# EasyEDA Pro project ProDoc_FLIP_C3_2024-10-24.epro

# Schematic flip_c3
Create Date: 2023-12-31; Page Name: P1; Project Name: FLIP_C3 Working; Schematic Name: flip_c3; Update Date: 2024-06-18; Company: Voidbox Industries; Drawed: @clomads; Page Size: A4; Part Number: JLCPCB-002; Reviewed: EasyEDA Pro; Version: 22.03
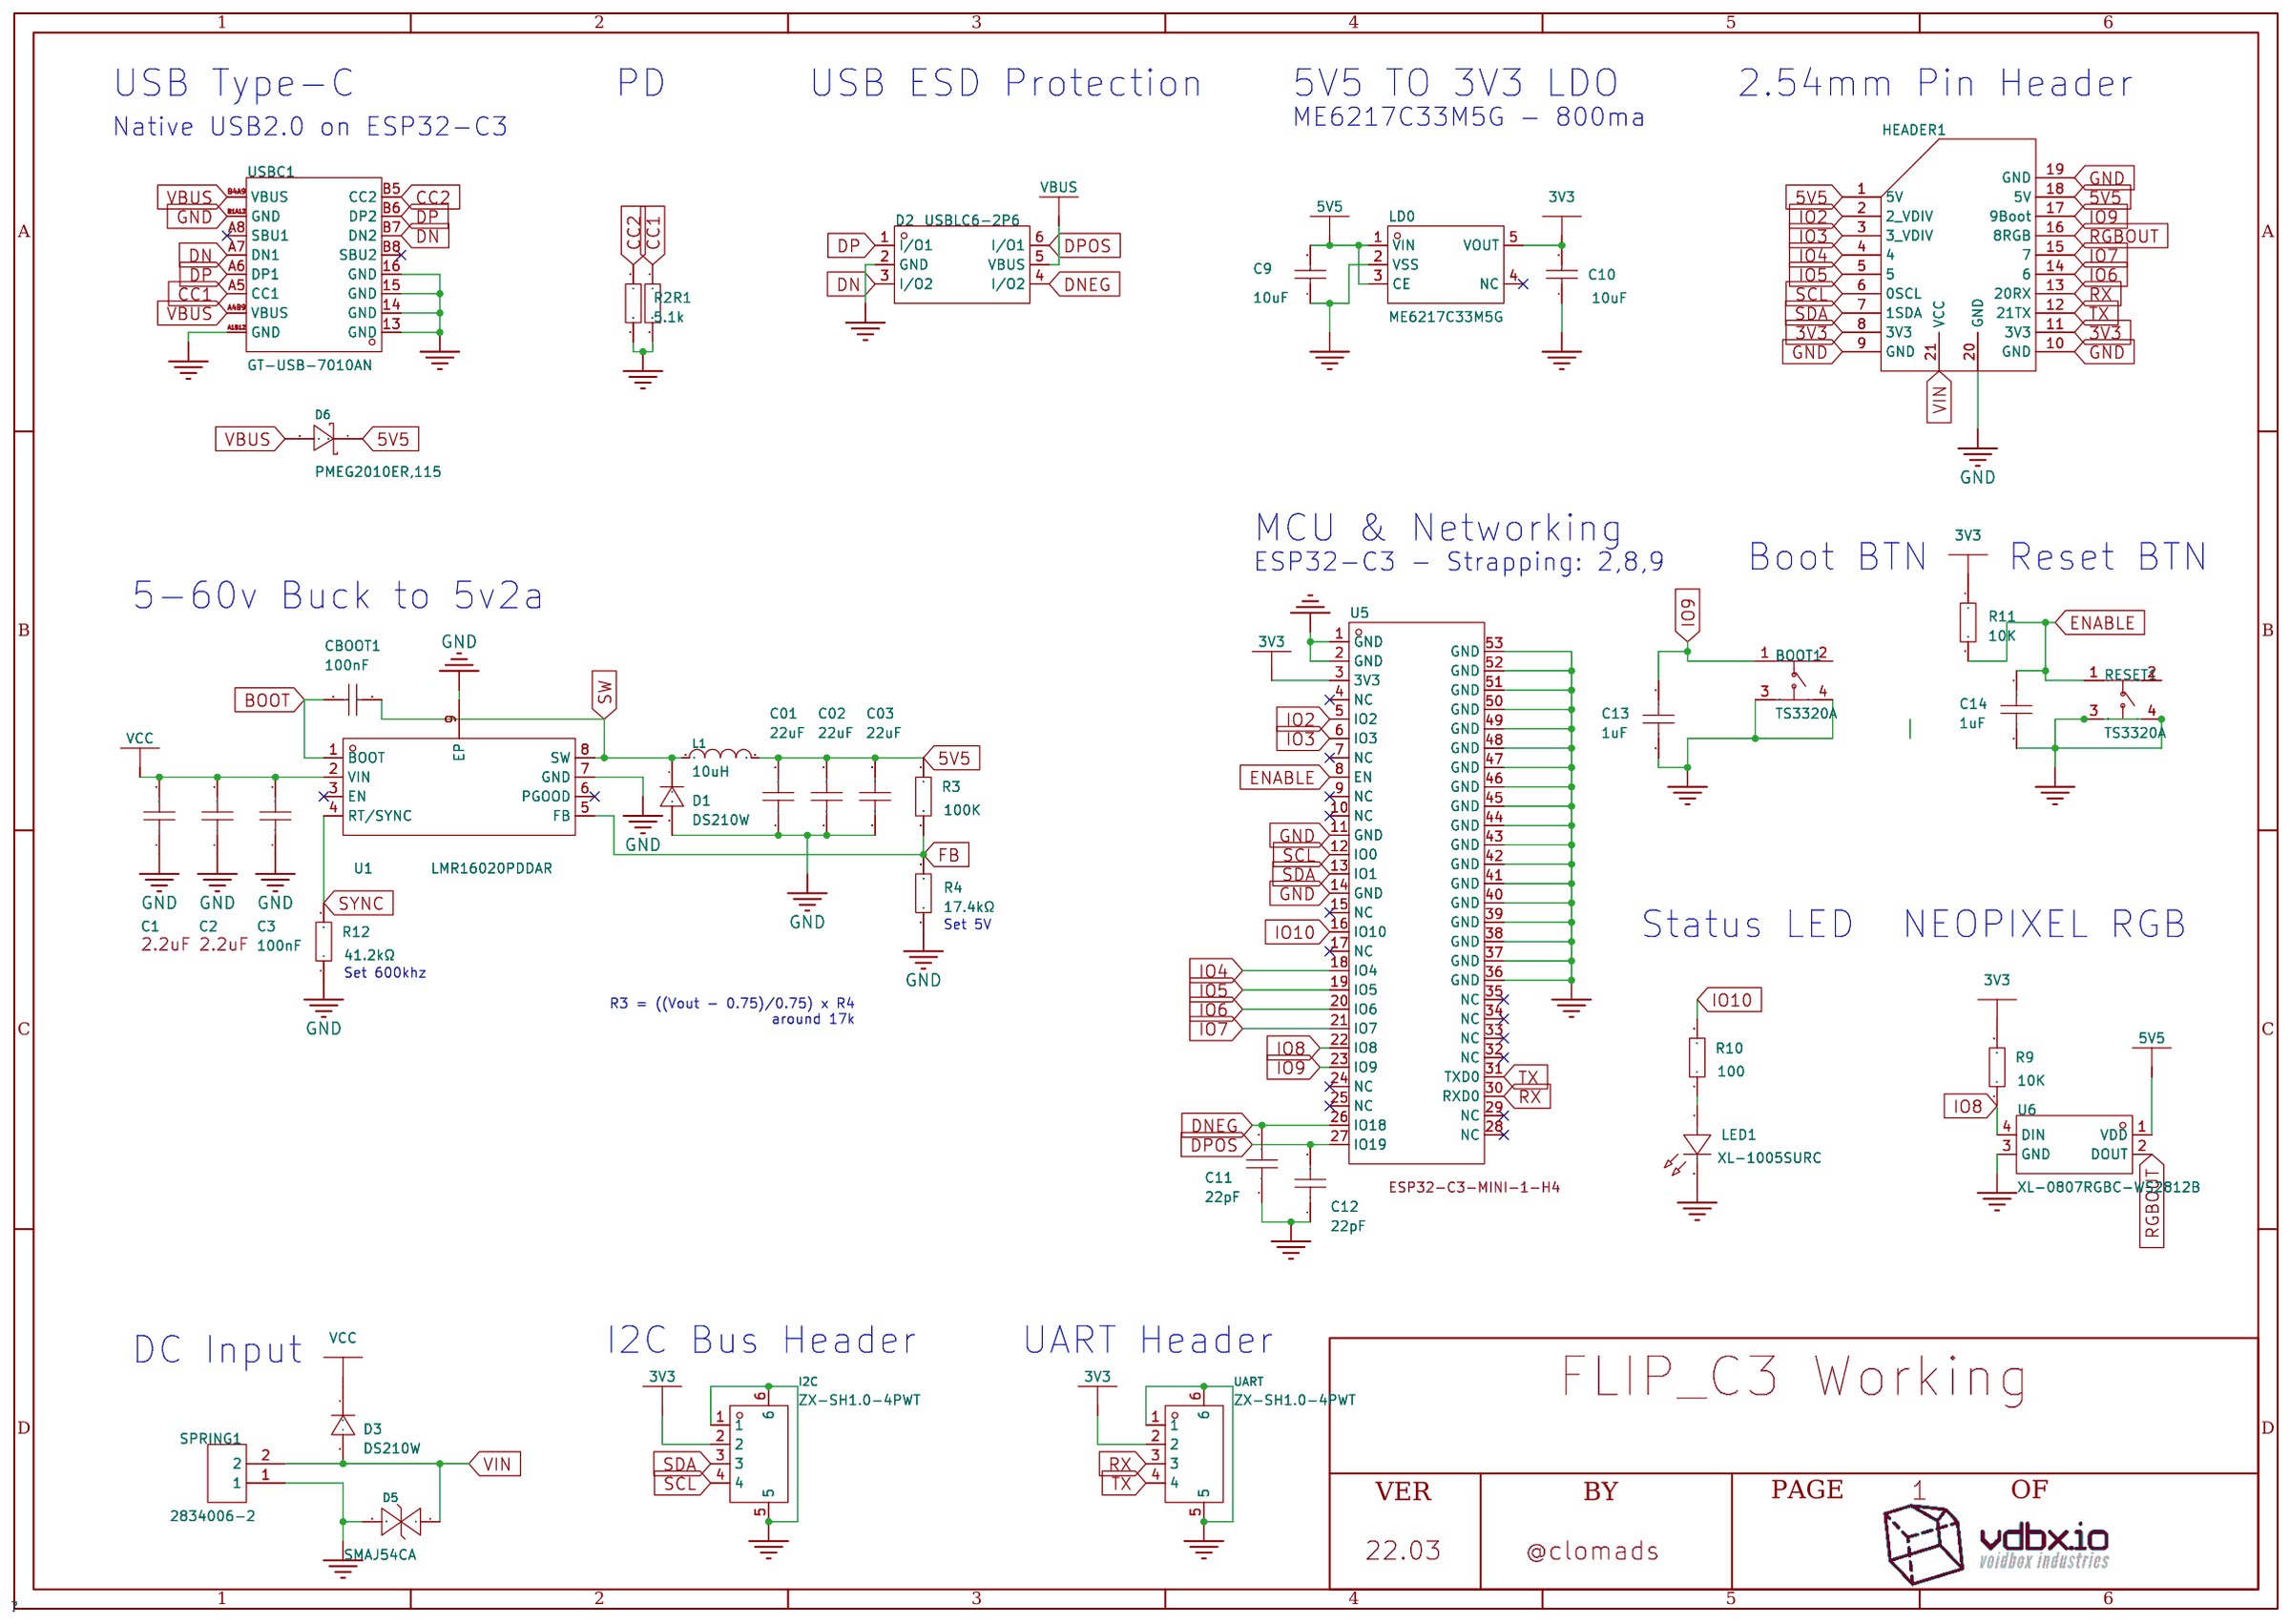
[diagram p0: schematic sheet]

## Parts
BOOT1  TS3320A  [KEY-SMD_4P-L3.3-W3.3-P2.20-LS3.9]
C1  CS3216X7R225K101NRI  [C1206]
C01  22uF  [C0805]
C2  CS3216X7R225K101NRI  [C1206]
C02  22uF  [C0805]
C3  100nF  [C0402]
C03  22uF  [C0805]
C9  10uF  [C0402]
C10  10uF  [C0402]
C11  22pF  [C0402]
C12  22pF  [C0402]
C13  1uF  [C0402]
C14  1uF  [C0402]
CBOOT1  100nF  [C0402]
D1  DS210W  [SOD-123FL_L2.7-W1.8-LS3.8-RD]
D2  USBLC6-2P6  [SOT-666-6_L1.6-W1.2-P0.50-LS1.6-BL]
D3  DS210W  [SOD-123FL_L2.7-W1.8-LS3.8-RD]
D5  SMAJ54CA  [SMA_L4.4-W2.6-LS5.0-BI]
D6  PMEG2010ER,115  [SOD-123_L2.6-W1.7-LS3.5-RD]
HEADER1  -  [VDBX//FLIP]
I2C  ZX-SH1.0-4PWT  [CONN-SMD_4P-P1.00_MEGASTAR_ZX-SH1.0-4PWT]
L1  10uH  [IND-SMD_L5.4-W5.2]
LD0  ME6217C33M5G  [SOT-23-5_L3.0-W1.7-P0.95-LS2.8-BR]
LED1  XL-1005SURC  [LED0402-R-RD_RED]
R1  5.1k  [R0402]
R2  5.1k  [R0402]
R3  100K  [R0402]
R4  17.4kΩ  [R0402]
R9  10K  [R0402]
R10  100  [R0402]
R11  10K  [R0402]
R12  41.2kΩ  [R0201]
RESET1  TS3320A  [KEY-SMD_4P-L3.3-W3.3-P2.20-LS3.9]
SPRING1  2834006-2  [CONN-SMD_2834006-2]
U1  LMR16020PDDAR  [SOIC-8_L4.9-W3.9-P1.27-LS6.0-BL-EP]
U5  2.4GHz  [WIFIM-SMD_ESP32-C3-MINI-1]
U6  XL-0807RGBC-WS2812B  [LED-SMD_4P-L2.0-W1.8_CY-0807]
UART  ZX-SH1.0-4PWT  [CONN-SMD_4P-P1.00_MEGASTAR_ZX-SH1.0-4PWT]
USBC1  GT-USB-7010AN  [USB-SMD_GT-USB-7010AN]

## Library data of the parts
BOOT1 RESET1 = TS3320A: Contact Current:50mA Voltage Rating (DC):12V Insulation Resistance:100MΩ Circuit:SPST Mounting Style:Brick nogging Actuator Style:Round Button Actuator/Cap Color:Black Mechanical Life:50000次 Operating Temperature:-25℃~+70℃ Operating Temperature:-25℃~+70℃; LCSC Part Name: 3.3*3.3*2mm立贴轻触开关-; Supplier Part: C2681475; Manufacturer: SHOUHAN(首韩); Supplier Footprint: SMD; JLCPCB Part Class: ExtendedPart; Datasheet: https://atta.szlcsc.com/upload/public/pdf/source/20210224/C2681475_49BAFF82C70BBEACA3FDEB8209DED2EE.pdf; Supplier: LCSC; Contact Current: 50mA; Voltage Rating (DC): 12V; Insulation Resistance: 100MΩ; Circuit: SPST; Mounting Style: Bricknogging; Actuator Style: RoundButton; Actuator/Cap Color: Black; Mechanical Life: 50000次; Operating Temperature: -25℃~+70℃; Pin Style: SMDSplicing; Switch Length: 3.3mm; Switch Width: 3.3mm; Switch Height: 2mm; Strike Gundam: NO
C1 = CS3216X7R225K101NRI: 2.2uF; LCSC Part Name: 2.2uF±10%100V; Supplier Part: C920964; Manufacturer: SAMWHA(三和); Supplier Footprint: 1206; Supplier: LCSC
C01 C02 C03 = CL21A226MAQNNNE_C45783: Capacitance: Tolerance:±20% Tolerance:±20% Voltage Rated: Temperature Coefficient:; LCSC Part Name: 22uF±20%25V; Supplier Part: C45783; Manufacturer: SAMSUNG(三星); Manufacturer Part: CL21A226MAQNNNE; Supplier Footprint: 0805; JLCPCB Part Class: BasicPart; Datasheet: https://atta.szlcsc.com/upload/public/pdf/source/20160103/1457707727161.pdf; Supplier: LCSC; Tolerance: ±20%
C2 = CS3216X7R225K101NRI: 2.2uF; LCSC Part Name: 2.2uF ±10% 100V; Supplier Part: C920964; Manufacturer: SAMWHA(三和); Supplier Footprint: 1206; Supplier: LCSC
C3 = GRM155R62A104KE14D: Capacitance: Tolerance:±10% Tolerance:±10% Voltage Rated: Temperature Coefficient:; LCSC Part Name: 100nF±10%100V; Supplier Part: C162178; Manufacturer: muRata(村田); Supplier Footprint: 0402; JLCPCB Part Class: ExtendedPart; Datasheet: https://atta.szlcsc.com/upload/public/pdf/source/20200921/C162178_EF61A2DC43497DE67E2F462D3389BE9B.pdf; Supplier: LCSC; Tolerance: ±10%
C9 C10 = CL05A106MQ5NUNC: Capacitance: Tolerance:±20% Tolerance:±20% Voltage Rated: Temperature Coefficient:; LCSC Part Name: 10uF±20%6.3V; Supplier Part: C15525; Manufacturer: SAMSUNG(三星); Supplier Footprint: 0402; JLCPCB Part Class: BasicPart; Datasheet: https://atta.szlcsc.com/upload/public/pdf/source/20220823/2B02EE04F8F211D38A52DCB16EB6BEBA.pdf; Supplier: LCSC; Tolerance: ±20%
C11 C12 = AC0402JRNPO9BN220: Capacitance: Tolerance:±5% Tolerance:±5% Voltage Rated: Temperature Coefficient:; LCSC Part Name: 22pF±5%50V; Supplier Part: C726125; Manufacturer: YAGEO(国巨); Supplier Footprint: 0402; JLCPCB Part Class: ExtendedPart; Datasheet: https://atta.szlcsc.com/upload/public/pdf/source/20200820/C726125_11F3A014E965DE2ED5817C34A65FFB04.pdf; Supplier: LCSC; Tolerance: ±5%
C13 C14 = TCC0402X5R105K6R3AT: Capacitance: Tolerance:±10% Tolerance:±10% Voltage Rated: Temperature Coefficient:; LCSC Part Name: 1uF±10%6.3V; Supplier Part: C380294; Manufacturer: CCTC(三环); Supplier Footprint: 0402; JLCPCB Part Class: ExtendedPart; Datasheet: https://atta.szlcsc.com/upload/public/pdf/source/20190416/C380294_EE4A8BABBF3DD61F3AECEC3178C6A1B3.pdf; Supplier: LCSC; Tolerance: ±10%
CBOOT1 = 0402B104K160NT: Capacitance: Tolerance:±10% Tolerance:±10% Voltage Rated: Temperature Coefficient:; LCSC Part Name: 100nF±10%16V; Supplier Part: C41851; Manufacturer: FH(风华); Supplier Footprint: 0402; JLCPCB Part Class: ExtendedPart; Datasheet: https://atta.szlcsc.com/upload/public/pdf/source/20170923/C41851_1506149456453988767.pdf; Supplier: LCSC; Tolerance: ±10%
D1 D3 = DS210W: Reverse Voltage (Vr):100V Average Rectified Current (Io):2A Forward Voltage (Vf@If):850mV@2A; LCSC Part Name: 100V2A850mV@2A; Supplier Part: C116100; Manufacturer: 晶导微电子; Supplier Footprint: SOD-123F; JLCPCB Part Class: ExtendedPart; Datasheet: https://atta.szlcsc.com/upload/public/pdf/source/20170630/1498816633495.pdf; Supplier: LCSC; Reverse Voltage (Vr): 100V; Average Rectified Current (Io): 2A; Forward Voltage (Vf@If): 850mV@2A
D2 = USBLC6-2P6: LCSC Part Name: MSL=3; Supplier Part: C2827693; Manufacturer: TECHPUBLIC(台舟); Supplier Footprint: SOT-666-6; JLCPCB Part Class: ExtendedPart; Datasheet: https://atta.szlcsc.com/upload/public/pdf/source/20210810/36353A9194EA9F4E33F8AE18BE051AEA.pdf; Supplier: LCSC
D5 = SMAJ54CA_C726801: LCSC Part Name: 双向TVS 54V截止 4.6A峰值脉冲; Supplier Part: C726801; Manufacturer: TWGMC(台湾迪嘉); Supplier Footprint: SMA(DO-214AC); JLCPCB Part Class: Extended Part; Datasheet: https://atta.szlcsc.com/upload/public/pdf/source/20200827/C726731_3930C18E0BE7F90724BF034A8102E5CA.pdf; Supplier: LCSC
D6 = PMEG2010ER,115: Forward Voltage (Vf@If):340mV@1A Reverse Voltage (Vr):20V Average Rectified Current (Io):1A Reverse Leakage Current (Ir):1mA@20V; LCSC Part Name: 电压:20V 电流:1A; Supplier Part: C82288; Manufacturer: Nexperia(安世); Supplier Footprint: SOD-123W; JLCPCB Part Class: Extended Part; Datasheet: https://atta.szlcsc.com/upload/public/pdf/source/20190724/C82288_10225E21959A121382FBC249BE727A6A.pdf; Supplier: LCSC; Forward Voltage (Vf@If): 340mV@1A; Reverse Voltage (Vr): 20V; Average Rectified Current (Io): 1A; Reverse Leakage Current (Ir): 1mA@20V
HEADER1 = VDBX//FLIP: 2.54mm DIP header for VDBX//FLIP
I2C UART = ZX-SH1.0-4PWT: Pins Structure:1x4P Pitch:1mm Mounting Style:Surface Mount Row Spacing:- Number of Pins:4P Number of Rows:1 Number of PINs Per Row:4 Reference Series:SH Current Rating (Max):1A Contact Material:Brass Contact Plating:Tin Operating Temperature Range:-25℃~+8; LCSC Part Name: 1x4P 间距:1mm 卧贴 系列:SH; Supplier Part: C7430446; Manufacturer: Megastar(兆星); Supplier Footprint: SMD,P=1mm; JLCPCB Part Class: Extended Part; Datasheet: https://atta.szlcsc.com/upload/public/pdf/source/20230619/390816C24B7A0EB1D042395C380CEA99.pdf; Supplier: LCSC; Pins Structure: 1x4P; Pitch: 1mm; Mounting Style: Surface Mount; Number of Pins: 4P; Number of Rows: 1; Number of PINs Per Row: 4; Reference Series: SH; Current Rating (Max): 1A; Contact Material: Brass; Contact Plating: Tin; Operating Temperature Range: -25℃~+85℃
L1 = YSPI0530-100M: Inductance: Tolerance:±20% Tolerance:±20% Rated Current: DC Resistance (DCR):; LCSC Part Name: 10uH ±20%; Supplier Part: C351099; Manufacturer: YJYCOIN(益嘉源); Supplier Footprint: SMD,5.4x5.2x3mm; JLCPCB Part Class: Extended Part; Datasheet: https://atta.szlcsc.com/upload/public/pdf/source/20200623/C351094_17389D97D1B03B4819FE4163F927344F.pdf; Supplier: LCSC; Tolerance: ±20%
LD0 = ME6217C33M5G: Supplier Part: C427602; Manufacturer: MICRONE(南京微盟); Supplier Footprint: SOT-23-5; Datasheet: https://atta.szlcsc.com/upload/public/pdf/source/20190910/C427602_D4B9162A2E9D9EF57C60010DFDECEF37.pdf; Supplier: LCSC
LED1 = XL-1005SURC: LCSC Part Name: 0402红色(Iv=100-110mcd(Typ)@IF=5mA); Supplier Part: C965790; Manufacturer: XINGLIGHT(成兴光); Supplier Footprint: 0402; JLCPCB Part Class: ExtendedPart; Datasheet: https://atta.szlcsc.com/upload/public/pdf/source/20201230/C965790_D08D7AE59F006B2C4755D0738B261672.pdf; Supplier: LCSC
R1-R3 R9-R11 = Res_0402: Supplier Footprint: 0402
R4 = AC0402FR-0717K4L: Type:Thick Film Resistors Resistance: Tolerance:±1% Tolerance:±1% Power(Watts): Temperature Coefficient:±100ppm/℃ Temperature Coefficient:±100ppm/℃ Overload Voltage (Max): Operating Temperature Range:-55℃~+155℃ Operating Temperature Range:-55℃~+155℃; LCSC Part Name: 17.4kΩ±1%62.5mW; Supplier Part: C226818; Manufacturer: YAGEO(国巨); Supplier Footprint: 0402; JLCPCB Part Class: ExtendedPart; Datasheet: https://atta.szlcsc.com/upload/public/pdf/source/20190123/C226818_28D8B305D22560CEE1489EF0EB7B82C0.pdf; Supplier: LCSC; Type: ThickFilmResistors; Tolerance: ±1%; Temperature Coefficient: ±100ppm/℃; Operating Temperature Range: -55℃~+155℃
R12 = RC0201FR-0741K2L: Type:Thick Film Resistors Resistance: Tolerance:±1% Tolerance:±1% Power(Watts): Temperature Coefficient:±200ppm/℃ Temperature Coefficient:±200ppm/℃ Overload Voltage (Max): Operating Temperature Range:-55℃~+125℃ Operating Temperature Range:-55℃~+125℃; LCSC Part Name: 41.2kΩ±1%50mW; Supplier Part: C327387; Manufacturer: YAGEO(国巨); Supplier Footprint: 0201; JLCPCB Part Class: ExtendedPart; Datasheet: https://atta.szlcsc.com/upload/public/pdf/source/20181031/C327387_F1DBB3BE8B4A4576AB16EF1D0BA24538.pdf; Supplier: LCSC; Type: ThickFilmResistors; Tolerance: ±1%; Temperature Coefficient: ±200ppm/℃; Operating Temperature Range: -55℃~+125℃
SPRING1 = 2834006-2: Pitch:4mm Number of PINs Per Row:2 Number of Rows:1 Mounting Style:Surface Mount Current Rating (Max):- Voltage Rating (Max):- Wire Gauge - AWG:- Wire Gauge - mm?:- Operating Temperature Range:- Operating Temperature Range:- Color:Creamy-White; LCSC Part Name: 4mm每排P数:2排数:1; Supplier Part: C86483; Manufacturer: TEConnectivity(美国泰科); Supplier Footprint: P=4mm; JLCPCB Part Class: ExtendedPart; Datasheet: https://atta.szlcsc.com/upload/public/pdf/source/20161105/1478330329472.pdf; Supplier: LCSC; Pitch: 4mm; Number of PINs Per Row: 2; Number of Rows: 1; Mounting Style: SurfaceMount; Color: Creamy-White
U1 = LMR16020PDDAR: Function:Step-down type Synchronous Rectification:NO Output Type:Adjustable Number of Outputs:1 Topology:Step-down Input Voltage:4.3V~60V Input Voltage:4.3V~60V Output Voltage:0.8V~50V Output Voltage:0.8V~50V Output Current (Max):2A Switching Frequency:2.; LCSC Part Name: 降压型Vin=4.3V~60VVout=800mV~50V2A; Supplier Part: C190006; Manufacturer: TI(德州仪器); Supplier Footprint: SOIC-8-EP; JLCPCB Part Class: ExtendedPart; Datasheet: https://atta.szlcsc.com/upload/public/pdf/source/20180404/C190006_9C8896A9199409761EDE7FC724CBBE1D.pdf; Supplier: LCSC; Function: Step-downtype; Synchronous Rectification: NO; Output Type: Adjustable; Number of Outputs: 1; Topology: Step-down; Input Voltage: 4.3V~60V; Output Voltage: 0.8V~50V; Output Current (Max): 2A; Switching Frequency: 2.5MHz; Operating Temperature: -40℃~+125℃@(TJ)
U5 = ESP32-C3-MINI-1-H4_C2934569: Frequency:2.4GHz Output Power:20.5dBm Output Power:20.5dBm Core Processor:RISC-V Support Interface:SPI Antenna Type:板载 PCB Antenna/外部Antenna连接器 Wireless Standard:802.11b/g/n Operating Voltage:3.3V Operating Voltage:3.3V Receive  Current:- Send  Current:-; LCSC Part Name: ESP32-C3-MINI-1-H4; Supplier Part: C2934569; Manufacturer: ESPRESSIF(乐鑫); Manufacturer Part: ESP32-C3-MINI-1-H4; Supplier Footprint: SMD,13.2x16.6mm; Datasheet: https://atta.szlcsc.com/upload/public/pdf/source/20211222/4A6E563D9536B67D492463D36DD57C1D.pdf; Supplier: LCSC; Output Power: 20.5dBm; Core Processor: RISC-V; Support Interface: SPI; Antenna Type: 板载PCBAntenna/外部Antenna连接器; Wireless Standard: 802.11b/g/n; Operating Voltage: 3.3V; Sensitivity: -96dBm; Operating Temperature: -40℃~+85℃
U6 = XL-0807RGBC-WS2812B: Emitted Color:RGB Diode Configuration:- Lens Color:Colorless Dominant Wavelength:- Dominant Wavelength:- Peak Wavelength:- Color Temperature:- Color Temperature:- Luminous Flux (@25℃):- Luminous Flux (@25℃):- Forward Current:20mA Forward Voltage (VF):3.5V; LCSC Part Name: RGB三色正贴; Supplier Part: C3646929; Manufacturer: XINGLIGHT(成兴光); Supplier Footprint: SMD,1.8x2mm; JLCPCB Part Class: ExtendedPart; Datasheet: https://atta.szlcsc.com/upload/public/pdf/source/20220704/8AC05C59AC3A71CCA97D1D2180172B1A.pdf; Supplier: LCSC; Emitted Color: RGB; Lens Color: Colorless; Forward Current: 20mA; Forward Voltage (VF): 3.5V~5.5V; Viewing Angle: 120°; Mounting Sytle: Positivepost; Operating Temperature: -40℃~+150℃
USBC1 = GT-USB-7010AN: LCSC Part Name: 16PINTYPE-C母座; Supplier Part: C963370; Manufacturer: G-Switch(品赞); Supplier Footprint: 8.94x3.16x7.35mm; JLCPCB Part Class: ExtendedPart; Supplier: LCSC

## Nets
3V3: C10.2 HEADER1.8(3V3) HEADER1.11(3V3) I2C.2 LD0.5(VOUT) R9.2 R11.1 U5.3(3V3) UART.2
5V5: C01.2 C02.2 C03.2 C9.2 D6.1(C) HEADER1.1(5V) HEADER1.18(5V) L1.2 LD0.1(VIN) LD0.3(CE) R3.2 U6.1(VDD)
GND: BOOT1.3 BOOT1.4 C1.1 C01.1 C2.1 C02.1 C3.1 C03.1 C9.1 C10.1 C11.1 C12.1 C13.2 C14.2 D1.2(A) D2.2(GND) D5.2 HEADER1.9(GND) HEADER1.10(GND) HEADER1.19(GND) HEADER1.20(GND) I2C.1 I2C.5 I2C.6 LD0.2(VSS) LED1.2(A) R1.2 R2.2 R4.1 R12.1 RESET1.3 RESET1.4 SPRING1.1 U1.7(GND) U1.9(EP) U5.1(GND) U5.2(GND) U5.11(GND) U5.14(GND) U5.36(GND) U5.37(GND) U5.38(GND) U5.39(GND) U5.40(GND) U5.41(GND) U5.42(GND) U5.43(GND) U5.44(GND) U5.45(GND) U5.46(GND) U5.47(GND) U5.48(GND) U5.49(GND) U5.50(GND) U5.51(GND) U5.52(GND) U5.53(GND) U6.3(GND) UART.1 UART.5 UART.6 USBC1.13(GND) USBC1.14(GND) USBC1.15(GND) USBC1.16(GND) USBC1.A1B12(GND) USBC1.B1A12(GND)
VBUS: D2.5(VBUS) D6.2(A) USBC1.A4B9(VBUS) USBC1.B4A9(VBUS)
VCC: C1.2 C2.2 C3.2 D3.1(C) U1.2(VIN)
VIN: D3.2(A) D5.1 HEADER1.21(VCC) SPRING1.2
BOOT: CBOOT1.2 U1.1(BOOT)
CC1: R1.1 USBC1.A5(CC1)
CC2: R2.1 USBC1.B5(CC2)
DN: D2.3(I/O2) USBC1.A7(DN1) USBC1.B7(DN2)
DNEG: C11.2 D2.4(I/O2) U5.26(IO18)
DP: D2.1(I/O1) USBC1.A6(DP1) USBC1.B6(DP2)
DPOS: C12.2 D2.6(I/O1) U5.27(IO19)
ENABLE: C14.1 R11.2 RESET1.1 U5.8(EN)
FB: R3.1 R4.2 U1.5(FB)
IO2: HEADER1.2(2 VDIV) U5.5(IO2)
IO3: HEADER1.3(3 VDIV) U5.6(IO3)
IO4: HEADER1.4 U5.18(IO4)
IO5: HEADER1.5 U5.19(IO5)
IO6: HEADER1.14(6) U5.20(IO6)
IO7: HEADER1.15(7) U5.21(IO7)
IO8: R9.1 U5.22(IO8) U6.4(DIN)
IO9: BOOT1.1 C13.1 HEADER1.17(9Boot) U5.23(IO9)
IO10: R10.2 U5.16(IO10)
RGBOUT: HEADER1.16(8RGB) U6.2(DOUT)
RX: HEADER1.13(20RX) U5.30(RXD0) UART.3
SCL: HEADER1.6(0SCL) I2C.4 U5.12(IO0)
SDA: HEADER1.7(1SDA) I2C.3 U5.13(IO1)
SW: CBOOT1.1 D1.1(C) L1.1 U1.8(SW)
SYNC: R12.2 U1.4(RT/SYNC)
TX: HEADER1.12(21TX) U5.31(TXD0) UART.4
$1N39228: LED1.1(K) R10.1

Not connected (* = marked no-connect by the designer): BOOT1 2; LD0 4(NC)*; RESET1 2; U1 3(EN)* 6(PGOOD)*; U5 4(NC)* 7(NC)* 9(NC)* 10(NC)* 15(NC)* 17(NC)* 24(NC)* 25(NC)* 28(NC)* 29(NC)* 32(NC)* 33(NC)* 34(NC)* 35(NC)*; USBC1 A8(SBU1)* B8(SBU2)*

## Notes on the sheet
- USB Type-C
- PD
- USB ESD Protection
- 5V5 TO 3V3 LDO
- 2.54mm Pin Header
- ME6217C33M5G - 800ma
- Native USB2.0 on ESP32-C3
- MCU & Networking
- ESP32-C3 - Strapping: 2,8,9
- Boot BTN
- Reset BTN
- 5-60v Buck to 5v2a
- Set 5V
- Status LED
- NEOPIXEL RGB
- Set 600khz
- R3 = ((Vout - 0.75)/0.75) x R4
  around 17k
- DC Input
- I2C Bus Header
- UART Header

# Board FLIP_C3
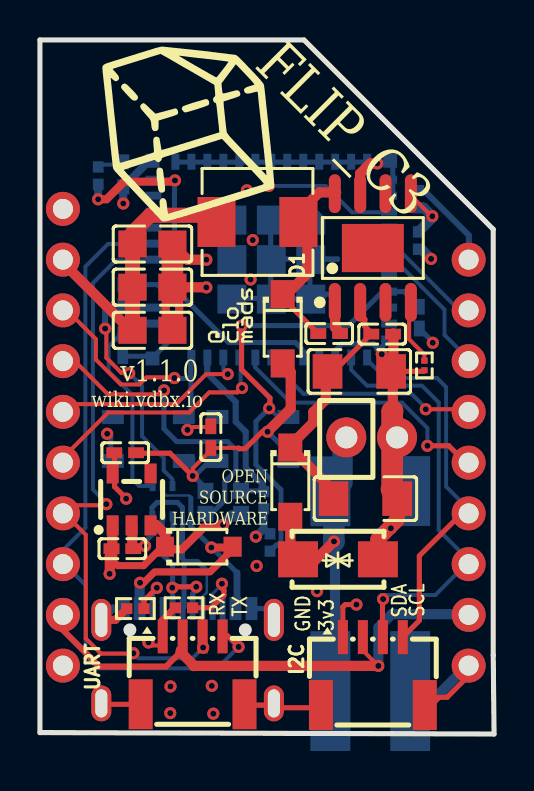
[diagram p1: board, top side]
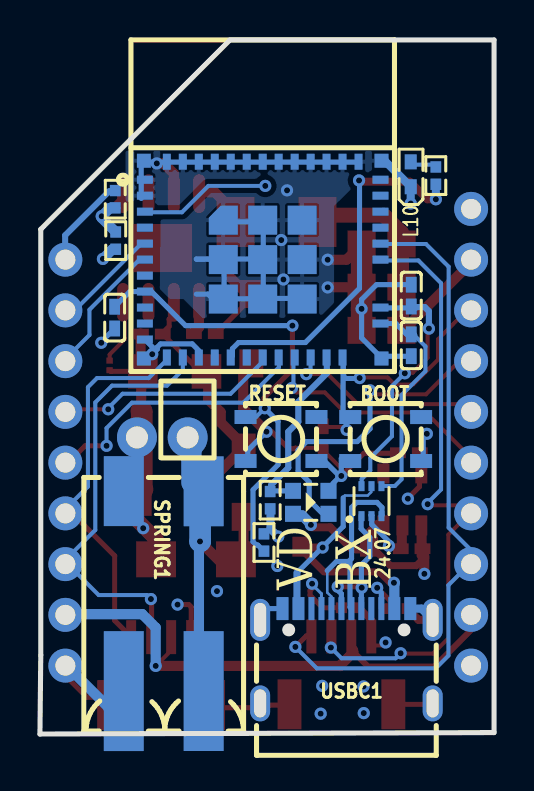
[diagram p2: board, bottom side, seen from below]

Outline 22.74 x 34.74 mm; copper layers: Top Layer, Inner1, Inner2, Bottom Layer. Coordinates in mm from the lower left corner of the outline.
Outline path: 0,34.74 13.22,34.74 22.7,25.26 22.7,3.95 22.74,0 0,0.07 0,34.74
Stack: Top Layer 0.035mm / Dielectric1 0.48mm PP er 4.5 / Inner1 0.035mm / Dielectric2 0.48mm FR4 er 4.5 / Inner2 0.035mm / Dielectric3 0.48mm PP er 4.5 / Bottom Layer 0.035mm

## Design rules (mm)
template: User Custom Config
spacing safeClearance (default): track to track 0.152, other pairs 0.152 to 0.3
track width trackWidth (default): min 0.102, default 0.254, max 2.54
differential pair differentialPair (default): width min 0.127, default 0.254, max 2.54; gap min 0.152, default 0.152
via viaSize (default): diameter min 0.5, default 0.61, max 10; hole min 0.3, default 0.305, max 6
net GND uses copperRegion6
pour e909 uses copperRegion6

## Placement (name value [footprint] x y rotation side)
BOOT  -  [KEY-SMD_4P-L3.3-W3.3-P2.20-LS3.9]  5.43 14.76 180 bottom
C01  22uF  [C0805]  5.63 24.52 180 top
C1  CS3216X7R225K101NRI  [C1206]  16 18.15 180 top
C02  22uF  [C0805]  5.63 22.37 180 top
C2  CS3216X7R225K101NRI  [C1206]  16.3 11.78 180 top
C3  100nF  [C0402]  17.14 20.02 180 top
C03  22uF  [C0805]  5.63 20.21 180 top
C9  10uF  [C0402]  4.13 9.28 180 top
C10  10uF  [C0402]  4.27 14.08 180 top
C11  22pF  [C0402]  4.15 19.46 90 bottom
C12  22pF  [C0402]  4.15 21.95 270 bottom
C13  1uF  [C0402]  8.56 14.86 270 top
C14  1uF  [C0402]  19 20.84 270 bottom
CBOOT1  100nF  [C0402]  14.48 20.05 0 top
D1  DS210W  [SOD-123FL_L2.7-W1.8-LS3.8-RD]  12.16 20.29 270 top
D2  USBLC6-2P6  [SOT-666-6_L1.6-W1.2-P0.50-LS1.6-BL]  6.14 11.66 180 bottom
D3  DS210W  [SOD-123FL_L2.7-W1.8-LS3.8-RD]  12.54 12.61 270 top
D5  SMAJ54CA  [SMA_L4.4-W2.6-LS5.0-BI]  14.93 8.75 0 top
D6  PMEG2010ER,115  [SOD-123_L2.6-W1.7-LS3.5-RD]  7.95 9.38 0 top
HEADER1  -  [VDBX//FLIP]  7.5 22.47 0 top
I2C  ZX-SH1.0-4PWT  [CONN-SMD_4P-P1.00_MEGASTAR_ZX-SH1.0-4PWT]  16.67 3.15 0 top
L1  10uH  [IND-SMD_L5.4-W5.2]  10.89 25.63 0 top
LD0  ME6217C33M5G  [SOT-23-5_L3.0-W1.7-P0.95-LS2.8-BR]  4.59 11.74 270 top
LED1  XL-1005SURC  [LED0402-R-RD_RED]  4.17 28.02 90 bottom
R1  5.1k  [R0402]  7.22 6.32 180 top
R2  5.1k  [R0402]  4.78 6.28 180 top
R3  100K  [R0402]  18.97 26.77 90 bottom
R4  17.4kΩ  [R0402]  18.95 24.7 90 bottom
R9  10K  [R0402]  11.21 11.7 270 bottom
R10  100  [R0402]  2.92 27.95 270 bottom
R11  10K  [R0402]  11.53 9.59 270 bottom
R12  41.2kΩ  [R0201]  19.25 18.45 90 top
RESET  -  [KEY-SMD_4P-L3.3-W3.3-P2.20-LS3.9]  10.67 14.77 180 bottom
SPRING1  2834006-2  [CONN-SMD_2834006-2]  16.54 7.15 270 bottom
U1  LMR16020PDDAR  [SOIC-8_L4.9-W3.9-P1.27-LS6.0-BL-EP]  16.67 24.33 0 top
U5  2.4GHz  [wifim-smd_esp32-c3-mini-1]  11.59 23.75 180 bottom
U6  XL-0807RGBC-WS2812B  [LED-SMD_4P-L2.0-W1.8_CY-0807]  9.18 11.6 0 bottom
UART  ZX-SH1.0-4PWT  [CONN-SMD_4P-P1.00_MEGASTAR_ZX-SH1.0-4PWT]  7.65 3.19 0 top
USBC1  GT-USB-7010AN  [USB-SMD_GT-USB-7010AN]  7.39 3.91 180 bottom

## Footprints (pads in the part's own frame, mm; a bottom-side part is the same pattern mirrored in y, then rotated)
C0402
  rect 0.79x0.54 smd: 1(-0.545,0) 2(0.545,0)
C0805
  rect 1.41x1.35 smd: 1(-1,0) 2(1,0)
C1206
  rect 1.485x1.728 smd: 1(-1.593,0) 2(1.593,0)
CONN-SMD_4P-P1.00_MEGASTAR_ZX-SH1.0-4PWT
  rect 0.5x1.7 smd: 1(-1.5,1.7) 2(-0.5,1.7) 3(0.5,1.7) 4(1.5,1.7)
  rect 1.2x2.5 smd: 5(2.6,-1.7) 6(-2.6,-1.7)
CONN-SMD_2834006-2
  rect 3.5x2 smd: 1(-5.005,-2) 2(-4.997,2)
  rect 6x2 smd: 1(5.005,-2) 2(5.002,2)
IND-SMD_L5.4-W5.2
  rect 1.9x2.5 smd: 1(2.05,0) 2(-2.05,0)
KEY-SMD_4P-L3.3-W3.3-P2.20-LS3.9
  rect 1.1x0.7 smd: 1(-1.775,1.1) 2(1.775,1.1) 3(-1.775,-1.1) 4(1.775,-1.1)
LED0402-R-RD_RED
  rect 0.75x0.6 smd: 1(0.623,0) 2(-0.623,0)
LED-SMD_4P-L2.0-W1.8_CY-0807
  rect 0.8x0.8 smd: 1(0.889,0.575) 2(-0.889,0.575) 3(-0.889,-0.575) 4(0.889,-0.575)
R0201
  rect 0.303x0.324 smd: 1(-0.241,0) 2(0.241,0)
R0402
  rect 0.566x0.54 smd: 1(-0.433,0) 2(0.433,0)
SMA_L4.4-W2.6-LS5.0-BI
  rect 2x1.8 smd: 1(-2,0) 2(2,0)
SOD-123_L2.6-W1.7-LS3.5-RD
  rect 0.9x1 smd: 1(-1.692,0) 2(1.692,0)
SOD-123FL_L2.7-W1.8-LS3.8-RD
  rect 1.4x1.2 smd: 1(-1.735,0) 2(1.735,0)
SOIC-8_L4.9-W3.9-P1.27-LS6.0-BL-EP
  oval 0.602x1.941 smd: 1(-1.905,-2.72) 2(-0.635,-2.72) 3(0.635,-2.72) 4(1.905,-2.72) 5(1.905,2.72) 6(0.635,2.72) 7(-0.635,2.72) 8(-1.905,2.72)
  rect 3.098x2.41 smd: 9(0,0)
SOT-23-5_L3.0-W1.7-P0.95-LS2.8-BR
  rect 1x0.6 smd: 1(1.3,-0.95) 2(1.3,0) 3(1.3,0.95) 4(-1.3,0.95) 5(-1.3,-0.95)
SOT-666-6_L1.6-W1.2-P0.50-LS1.6-BL
  rect 0.3x0.5 smd: 1(-0.5,-0.75) 2(0,-0.75) 3(0.5,-0.75) 4(0.5,0.75) 5(0,0.75) 6(-0.5,0.75)
USB-SMD_GT-USB-7010AN
  oval 1x2.1 hole 0.6x1.7: 13(-4.32,1.808) 14(4.32,1.808)
  oval 1x1.8 hole 0.6x1.4: 15(-4.32,-2.373) 16(4.32,-2.373)
  rect 0.6x1.15 smd: A1B12(-3.2,2.373) A4B9(-2.4,2.373) B1A12(3.2,2.373) B4A9(2.4,2.373)
  rect 0.3x1.15 smd: A5(-1.25,2.373) A6(-0.25,2.373) A7(0.25,2.373) A8(1.25,2.373) B5(1.75,2.373) B6(0.75,2.373) B7(-0.75,2.373) B8(-1.75,2.373)
VDBX//FLIP
  round 1.7 hole 1: 1(13.97,1.27) 2(13.97,-1.27) 3(13.97,-3.81) 4(13.97,-6.35) 5(13.97,-8.89) 6(13.97,-11.43) 7(13.97,-13.97) 8(13.97,-16.51) 9(13.97,-19.05) 10(-6.35,-19.05) 11(-6.35,-16.51) 12(-6.35,-13.97) 13(-6.35,-11.43) 14(-6.35,-8.89) 15(-6.35,-6.35) 16(-6.35,-3.81) 17(-6.35,-1.27) 18(-6.35,1.27) 19(-6.35,3.81)
  round 2 hole 1.1: 20(10.384,-7.628) 21(7.844,-7.628)
wifim-smd_esp32-c3-mini-1
  rect 0.8x0.4 smd: 1(-5.9,4) 2(-5.9,3.2) 3(-5.9,2.4) 4(-5.9,1.6) 5(-5.9,0.8) 6(-5.9,0) 7(-5.9,-0.8) 8(-5.9,-1.6) 9(-5.9,-2.4) 10(-5.9,-3.2) 11(-5.9,-4) 26(5.9,-3.2) 27(5.9,-2.4) 30(5.9,0) 31(5.9,0.8) 32(5.9,1.6) 33(5.9,2.4) 34(5.9,3.2) 35(5.9,4)
  rect 0.4x0.8 smd: 12(-4.8,-4.9) 13(-4,-4.9) 14(-3.2,-4.9) 15(-2.4,-4.9) 16(-1.6,-4.9) 17(-0.8,-4.9) 18(0,-4.9) 19(0.8,-4.9) 20(1.6,-4.9) 21(2.4,-4.9) 22(3.2,-4.9) 23(4,-4.9) 36(4.8,4.9) 37(4,4.9) 38(3.2,4.9) 39(2.4,4.9) 40(1.6,4.9) 41(0.8,4.9) 42(0,4.9) 43(-0.8,4.9) 44(-1.6,4.9) 45(-2.4,4.9) 46(-3.2,4.9) 47(-4,4.9) 48(-4.8,4.9)
  rect 0.003x0.003 smd: 24(4.8,-4.9) 25(5.9,-4) 28(5.9,-1.6) 29(5.9,-0.8)
  rect 1.45x1.45 smd: 49(-1.975,-1.975) 49(-1.975,0) 49(0,-1.975) 49(0,0) 49(0,1.975) 49(1.975,-1.975) 49(1.975,0) 49(1.975,1.975)
  custom 1.45x1.45 smd: 49(-1.975,1.975)
  rect 0.7x0.7 smd: 50(5.95,4.95) 51(5.95,-4.95) 52(-5.95,-4.95) 53(-5.95,4.95)

## Nets
As in the schematic, except:
GND: BOOT.3 BOOT.4 C01.1 C1.1 C02.1 C2.1 C3.1 C03.1 C9.1 C10.1 C11.1 C12.1 C13.2 C14.2 D1.2 D2.2 D5.2 HEADER1.9 HEADER1.10 HEADER1.19 HEADER1.20 I2C.1 I2C.5 I2C.6 LD0.2 LED1.2 R1.2 R2.2 R4.1 R12.1 RESET.3 RESET.4 SPRING1.1 U1.7 U1.9 U5.1 U5.2 U5.11 U5.14 U5.36 U5.37 U5.38 U5.39 U5.40 U5.41 U5.42 U5.43 U5.44 U5.45 U5.46 U5.47 U5.48 U5.49 U5.50 U5.51 U5.52 U5.53 U6.3 UART.1 UART.5 UART.6 USBC1.13 USBC1.14 USBC1.15 USBC1.16 USBC1.A1B12 USBC1.B1A12
ENABLE: C14.1 R11.2 RESET.1 U5.8
IO9: BOOT.1 C13.1 HEADER1.17 U5.23

Pads without a net: BOOT 2; LD0 4; RESET 2; U1 3 6; U5 4 7 9 10 15 17 24 25 28 29 32 33 34 35; USBC1 A8 B8

## Via types
v1: diameter 0.61, hole 0.305, Top Layer to Bottom Layer, 55 vias
v2: diameter 0.61, hole 0.304, Top Layer to Bottom Layer, 1 via

## Routing (per net, layer and track width the routed paths; a pad name or vN(x,y) marks a point on that pad's centre or on a via; arc(x,y) is an arc through that point)
3V3: length 80.9
  Top Layer w0.2: v1(16.95,3.41) 16.1,4.26 16.1,4.95
  Top Layer w0.254: 4.25,11.86 4.35,11.76 ; 4.25,11.86 4.31,11.92 ; 4.25,11.86 3.74,12.38 3.74,14.08 ; 4.25,11.86 4.22,11.83 ; 7.13,4.38 7.13,5.16
  Top Layer w0.3: 7.19,4.25 6.31,3.37 2.98,3.37 1.06,5.29
  Top Layer w0.508: 1.15,6.3 1.15,5.54 1.3,5.39 1.3,5.39 ; 7.05,4.2 7.05,4.09 7.66,3.48 ; 7.69,3.4 7.7,3.41 v1(16.95,3.41)
  Inner1 w0.254: 3.97,11.78 3.97,9.83 2.52,8.38 2.52,7.49 1.17,6.15 ; 3.97,11.78 4.55,11.2 9.49,11.2 v1(10.81,9.88) ; 3.97,11.78 4.31,11.78 v1(4.32,11.78) ; 11.47,27.42 11.47,27.35 ; 11.47,27.42 v1(11.46,27.44) ; 11.47,27.42 11.47,27.51 10.04,28.93 3.5,28.93 2.32,27.75 2.32,12.64 2.87,12.09 3.58,12.09 3.88,11.78
  Bottom Layer w0.2: 17.49,26.12 15.63,26.12 14.31,27.44 v1(11.46,27.44)
  Bottom Layer w0.4: v1(10.81,9.88) 11.2,10.27 11.2,11.26
  Bottom Layer w0.508: 21.49,6 17.62,6 16.95,5.33 v1(16.95,3.41)
5V5: length 68.2
  Top Layer w0.35: 3.5,8.83 3.9,8.43 5.19,8.43 6,9.24 6.28,9.24
  Top Layer w0.4: 9.14,10.35 8.21,10.35 7.1,9.24 6.28,9.24
  Top Layer w0.508: 4.38,20.36 1.29,23.45 1.29,23.78 ; 5.8,10.48 6.28,10 6.28,9.24 ; 3.5,8.9 3.5,8.01 ; 3.63,8.94 3.63,10.57
  Top Layer w0.75: 4.65,22.62 4.67,22.64 ; 4.69,20.51 4.72,20.51 4.73,20.5 ; L1.2 8.51,25.97 5.52,25.97 4.63,25.08 C01.2 C02.2 C03.2
  Inner2 w0.508: 2.5,19.85 3.53,18.82 15.29,18.82 17.09,20.62 18.24,20.62 21.5,23.88 ; 2.5,19.85 2.5,9 v1(3.49,8.02) ; 2.5,19.85 2.5,22.6 1.2,23.9 1.2,23.98
  Bottom Layer w0.3: 21.48,24.43 21.48,24.96 19.27,27.17 18.98,27.17
  Bottom Layer w0.508: 9.23,10.5 9.23,10.56 9.61,10.94 9.84,10.94 9.9,11
  vias: v1(9.17,10.47)
GND: length 113.2
  Top Layer w0.2: 8.66,14.35 8.66,14.3 7.65,13.3 v1(7.65,12.92) ; 6.08,4.43 5.59,4.43 v1(5.43,4.58) ; 8.81,14.31 8.83,14.32 9.94,14.32
  Top Layer w0.254: v1(7.65,12.92) 6.51,14.05 4.87,14.05 ; 11.54,1.44 10.37,1.44 10.33,1.4 ; 11.54,1.44 11.59,1.49 11.76,1.32 13.87,1.32 ; 11.54,1.44 11.58,1.44 ; 4.72,1.49 3.25,1.49 3.2,1.53 ; 21.62,3.07 20.39,1.84 19.99,1.84 19.47,1.32 ; 4.84,14.03 4.87,14.05 ; 4.87,14.05 4.83,14.05 ; v1(11.4,15.13) 11.13,15.13 10.28,14.28 9.98,14.28 9.95,14.32 ; 17.67,18.15 19.2,18.15 R12.1 ; v1(15.85,6.48) 15.29,6.48 15.17,6.36 15.17,4.89
  Top Layer w0.35: 6.12,5.16 6.12,5.67 6.77,6.32
  Top Layer w0.4: USBC1.14 3.78,5.71 R2.2
  Top Layer w0.508: 17.67,18.15 17.67,16.32 17.67,16.16 ; 17.67,18.15 17.67,18.2 ; 17.67,18.15 17.55,18.15 ; 6.64,22.36 8.33,22.36 v1(8.33,22.35) ; v1(11.4,15.13) 12.56,16.29 12.56,18.11 12.05,18.62 ; v1(16.89,28.56) 16.54,28.56 16.03,28.05 16.03,27.1 ; 17.6,18.38 17.7,18.48 17.7,20.05 ; v1(8.33,23.74) 7.39,23.74 6.86,24.27 ; 4.62,9.4 4.62,10.48
  Top Layer w0.75: D5.2 16.93,9.76 17.89,10.72 C2.1
  Top Layer w1.08: 17.67,16.16 17.64,16.14 17.64,12.28 17.61,12.24 ; C01.1 C02.1 ; C03.1 v1(6.63,21.28) 6.63,22.25
  Inner1 w0.254: 21.52,3.46 19.81,3.46 19.71,3.55
  Inner2 w0.5: 21.43,3.55 19.43,3.55
  Bottom Layer w0.25: C14.2 19.67,19.63 v1(19.67,19.58)
  Bottom Layer w0.254: 13.52,23.74 13.52,21.78 ; 13.52,21.78 13.54,21.76 ; 13.52,21.78 13.57,21.78 ; 13.52,21.78 11.58,21.78 ; 14.79,19.2 15.12,19.53 16.7,19.53 16.87,19.36 16.87,19.26 v1(17.12,19.01) 17.12,19.38 17.49,19.75 ; 11.57,21.77 11.58,21.78 11.58,21.78 ; v1(3.37,15.03) 3.55,14.85 3.55,13.92 ; 10.81,6.28 11.36,6.28 11.92,5.71 ; 4.09,18.91 5.55,18.91 5.63,18.82 6.63,19.83 v1(6.63,21.28) 6.63,21.74 5.88,22.49 4.12,22.49 ; 6.13,10.94 6.14,10.95 6.17,10.95 ; 6.13,10.94 6.13,10.94 ; 6.13,10.94 6.13,10.49 5.23,9.6 5.23,9.24 ; 17.47,28.62 17.67,28.42 17.67,26.81 ; 17.47,28.62 6.85,28.62 ; 17.47,28.62 17.47,28.66 ; 17.47,28.62 17.5,28.62 ; 11.68,25.64 13.71,25.64 13.72,25.64 ; 13.56,23.78 14.91,23.78 14.89,23.76 13.56,23.78 ; 13.56,23.78 11.62,23.78 11.58,23.82 ; 11.56,25.34 11.56,23.69 11.59,23.66 ; 9.76,21.81 11.56,21.81 ; 11.56,21.81 11.59,21.81 11.65,21.86 ; 11.56,21.81 11.56,21.72 11.54,21.7 ; 11.56,21.81 11.56,23.54 ; 8.59,13.76 7.75,12.92 v1(7.65,12.92) 7.65,13.79 7.6,13.84 ; 11.58,21.78 11.57,21.79 ; 14.91,22.02 14.33,22.02 14.01,21.7 ; 12.34,13.93 12.34,14.19 v1(11.4,15.13) ; 8.07,12.54 7.82,12.8 7.68,12.8
  Bottom Layer w0.4: LED1.2 5.48,28.7 U5.50 ; USBC1.B1A12 3.64,6.28 USBC1.14 ; v1(4.17,26.55) 4.17,27.39
  Bottom Layer w0.508: v1(19.59,23.78) 19.11,24.27 R4.1 ; 21.17,3.19 19.27,1.29 18.55,1.29
  vias: v1(5.27,9.42) v1(6.54,2.38) v1(6.53,1.05) v1(8.61,2.41) v1(8.68,1.02) v1(10.37,27.21) v1(10.55,22.75) v1(10.66,24.72) v1(10.85,8.41) v1(17.57,10.3) v2(13.88,7.15)
VBUS: length 16
  Top Layer w0.35: 8.44,8.11 5.82,8.11 ; D6.2 9.65,9.24 8.52,8.11 ; 5.74,8.11 5.2,7.57 v1(5.01,7.57)
  Top Layer w0.4: v1(8.59,9.33) 9.61,9.33 D6.2
  Bottom Layer w0.127: 7.6,11.81 7.47,11.94 6.33,11.94 6.15,12.11 6.15,12.41
  Bottom Layer w0.25: 7.56,10.39 9.87,8.07
  Bottom Layer w0.254: 7.56,11.83 7.56,10.39
  Bottom Layer w0.35: 9.87,8.07 9.87,6.34
  Bottom Layer w0.508: v1(5.01,7.57) 5,7.55 USBC1.B4A9
VCC: length 12.8
  Top Layer w0.254: 16.02,22.01 16.02,21.02 16.27,20.77 16.27,20.41 16.63,20.04 ; 16.53,20.05 16.55,20.03 16.55,19.98 14.73,18.16 14.49,18.16
  Top Layer w0.508: 12.78,14.69 13.69,15.59 13.69,16.12 14.32,16.74 14.32,18 14.35,18.04 ; 14.4,18.1 14.4,18.06 14.56,18.22 ; C2.2 14.71,12.17 D3.1
VIN: length 17
  Top Layer w0.508: v1(14.73,9.64) 13.67,8.58 12.54,8.58 D3.2
  Bottom Layer w0.508: 14.78,2.09 14.78,9.59
  Bottom Layer w1.016: 15.16,12.58 15.16,14.47 15.57,14.89
  Bottom Layer w1.08: 14.72,11.73 14.72,9.65 v1(14.73,9.64)
BOOT: length 2
  Top Layer w0.508: 15.01,20.12 14.78,20.35 14.78,22.07
CC1: length 4
  Top Layer w0.254: R1.1 8.59,6.32 9.22,6.95 9.22,7.19 9.09,7.32 9.09,7.61
  Bottom Layer w0.15: 9.15,7.53 8.64,7.02 USBC1.A5
  vias: v1(9.11,7.52)
CC2: length 2.1
  Top Layer w0.254: 5.21,6.28 5.21,6.68 5.75,7.22 5.91,7.22
  Bottom Layer w0.255: 5.64,7.08 USBC1.B5
  vias: v1(5.85,7.32)
DN: length 10.5
  Bottom Layer w0.127: USBC1.B7 8.14,6.88 8.35,7.09 8.35,8.18
  Bottom Layer w0.254: 7.88,8.64 7.28,8.64 7.14,8.78 7.14,11.34 6.88,11.59 5.87,11.59 5.61,11.34 5.61,10.97 5.66,10.93 ; USBC1.A7 7.22,6.35 7.22,8.64 ; 8.35,8.18 7.91,8.62
DNEG: length 11.1
  Bottom Layer w0.2: 5.65,12.4 5.63,12.42 4.96,12.42 4.63,12.75 4.63,16.97 3.44,18.16 3.44,19.4 4.03,19.99
  Bottom Layer w0.254: 3.99,19.98 3.98,19.98 3.98,19.96 ; 4.02,20.01 4.38,20.01 4.92,20.55 U5.26
DP: length 7.2
  Top Layer w0.254: v1(7.83,7.37) 6.89,7.37 6.85,7.41
  Bottom Layer w0.254: 7.81,7.37 7.77,7.33 7.77,7.15 7.64,7.02 USBC1.A6 ; 6.66,10.98 6.66,10.27 6.22,9.84 6.22,8.88 6.65,8.46 6.64,7.43 USBC1.B6 ; 6.64,7.43 6.63,7.44
  vias: v1(6.63,7.32)
DPOS: length 12.7
  Top Layer w0.2: 4.55,18.01 4.47,18.09 4.07,18.09 4.07,18.09 3.33,18.83 3.33,20.07 3.22,20.18
  Bottom Layer w0.2: 3.95,21.32 3.96,21.32 ; v1(4.47,18.06) 5.11,17.41 5.11,14.9 6.2,13.82 6.2,13.19 6.63,12.76 6.63,12.45 6.65,12.43
  Bottom Layer w0.254: 5.71,21.33 5.7,21.33 4.2,21.33
  Bottom Layer w0.305: 3.95,21.32 3.9,21.37 3.47,21.37 3.26,21.16 v1(3.26,20.29)
ENABLE: length 24.1
  Top Layer w0.254: v1(10.1,20.44) 10.1,18.24 11.52,16.82 11.52,16.33
  Bottom Layer w0.2: 12.6,15.88 11.91,15.88 v1(11.48,16.31)
  Bottom Layer w0.25: v1(11.48,16.31) 10.82,15.64 10.82,13.48 12.07,12.22 12.07,9.62 11.91,9.46 11.83,9.46 R11.2
  Bottom Layer w0.254: v1(10.1,20.44) 15.45,20.44 17.15,22.15 U5.8 18.24,22.15 C14.1
FB: length 3.4
  Top Layer w0.2: 18.54,26.99 19.53,26.01 19.61,26.01
  Bottom Layer w0.508: R3.1 19.23,26.34 v1(19.65,25.92) 19.65,25.83 R4.2
IO2: length 5.4
  Bottom Layer w0.2: 21.5,21.34 20.87,21.34 17.69,24.52 17.41,24.52
IO3: length 6.7
  Bottom Layer w0.2: 21.41,18.83 20.26,19.97 20.26,21.24 17.81,23.69 17.49,23.69
IO4: length 11.4
  Top Layer w0.2: v1(19.32,16.25) 21.41,16.25 21.51,16.35
  Bottom Layer w0.2: 11.57,18.87 11.57,19.02 ; 11.58,18.8 11.59,18.81 11.59,18.64 13.2,17.03 18.61,17.03 19.38,16.25
  Bottom Layer w0.254: U5.18 11.59,18.81
IO5: length 13.6
  Top Layer w0.254: v1(19.41,14.43) 20.48,14.43 21.13,13.77 21.49,13.77
  Bottom Layer w0.2: v1(19.41,14.43) 19.41,15.31 18.13,16.58 12.55,16.58 10.77,18.36 10.77,18.86
IO6: length 12
  Top Layer w0.2: v1(10.12,17.32) 9.9,17.1 8.48,17.1 7.48,16.1 3.42,16.1 1.14,13.82
  Bottom Layer w0.2: v1(10.12,17.32) 10.05,17.39 10.05,18.83
IO7: length 9.4
  Top Layer w0.2: 1.51,16.51 6.82,16.51 8.32,18.01 v1(9.4,18.01)
  Bottom Layer w0.2: v1(9.4,18.01) 9.19,18.23 9.19,18.78
IO8: length 9
  Bottom Layer w0.254: U6.4 11.18,12.17
  Bottom Layer w0.305: 11.16,12.1 11.16,12.47 10.31,13.32 10.31,15.13 9.8,15.63 9.8,16.63 8.38,18.05 8.38,18.83
IO9: length 14.6
  Top Layer w0.2: 1.17,21.39 2.8,19.76 2.8,18.74 4.05,17.5 4.98,17.5 5.34,17.85 6.7,17.85 v1(6.73,17.82) ; v1(7.38,15.22) 7.53,15.37 8.66,15.37 8.65,15.36
  Bottom Layer w0.127: 7.47,15.83 7.47,15.31 v1(7.38,15.22)
  Bottom Layer w0.254: 7.56,18.78 7.56,15.94 7.46,15.84 ; 7.56,18.78 7.56,18.78 ; 7.56,18.78 7.53,17.9 7.43,17.8 6.76,17.8
IO10: length 18.5
  Top Layer w0.4: v1(2.91,26.76) 3.34,26.76 4.22,27.65 6.7,27.65 v1(6.76,27.71)
  Bottom Layer w0.254: U5.16 13.1,18.93 13.1,19.29 12.8,19.6 9.45,19.6 6.74,22.31 6.74,27.68 v1(6.76,27.71)
  Bottom Layer w0.4: v1(2.91,26.76) 2.91,27.51 R10.2
RGBOUT: length 15.6
  Top Layer w0.2: v1(6.21,17.2) 6.01,17 3.41,17 1.5,18.91
  Bottom Layer w0.254: v1(6.21,17.2) 6.21,15.28 6.85,14.64 9.39,14.64 9.81,14.21 9.81,13.17 9.26,12.62 9.26,11.7 8.55,10.99 8.25,10.99
RX: length 29.9
  Top Layer w0.2: v1(4.68,4.04) 4.66,4.03 3.05,4.03 2.29,4.78 2.29,9.97 1.25,11.02 ; 1.64,11.45 3.27,11.45 v1(3.32,11.5)
  Bottom Layer w0.2: v1(8.17,4.33) 7.64,3.79 4.93,3.79 v1(4.68,4.04) ; 3.39,11.58 3.39,11.51 2.65,12.24 2.65,22.57 3.79,23.7 5.78,23.7
SCL: length 19.2
  Top Layer w0.254: I2C.4 19,5.68 19,8.92 21.55,11.47
  Bottom Layer w0.2: 21.49,11.23 20.34,12.38 20.34,17.36 19.88,17.82 17.3,17.82 16.32,18.79
SDA: length 21.2
  Top Layer w0.254: 17.15,5.02 17.15,6.72 v1(17.19,6.76)
  Bottom Layer w0.2: 15.56,18.92 15.59,18.9 15.59,18.23 16.38,17.44 19.13,17.44 19.97,16.6 19.97,10.21 21.44,8.75 21.44,8.59 19.8,6.96 17.39,6.96 v1(17.19,6.76)
  Bottom Layer w0.254: 21.44,8.75 21.49,8.69
SW: length 8.9
  Top Layer w0.254: D1.1 12.09,21.95 12.09,21.89 13.93,20.04
  Top Layer w0.508: 13.24,26.37 13.98,27.11 14.83,27.11 ; 12.32,21.97 13.4,23.04 13.4,25.74
SYNC: length 3.4
  Top Layer w0.2: 18.49,21.73 18.49,19.76 19.25,18.99 R12.2
TX: length 33.6
  Top Layer w0.254: v1(9.95,4.36) 9.4,4.92 9.05,4.92
  Bottom Layer w0.2: 1.19,8.67 1.19,9.24 2.28,10.33 2.28,23.39 3.41,24.53 5.69,24.53 ; v1(9.95,4.36) 8.88,3.29 2.92,3.29 2.29,3.92 2.29,7.45 1.24,8.49
$1N39228: length 1.3
  Bottom Layer w0.2: 2.93,28.5 4.12,28.5 4.22,28.6

## Copper pours and planes (outline as drawn; the poured copper is in the pictures)
GND on Bottom Layer: 8.01,21.59 8.01,26.43 6.87,27.57 5.22,27.57 5.22,29.2 18.35,29.2 18.46,29.31 18.46,26.65 17.1,26.65 16.69,26.24 16.75,21.78 15.55,21.77 14.43,20.65 8.95,20.65
GND on Inner1: -1.86,29.35 21.2,29.35 21.2,-2.75 -1.86,-2.75
GND on Inner2: -8.26,29.3 21.27,29.3 21.27,-0.06 -8.26,-0.06

## Text on the board
Bottom Silkscreen Layer: L10 | 24.07 | VD / BX
Top Silkscreen Layer: RX | TX | GND | 3v3 | SDA | SCL | OPEN / SOURCE / HARDWARE | wiki.vdbx.io | v1.1.0 | FLIP_C3
